# EAGLE design SmartSocket_Eth (EAGLE 6.6.0)
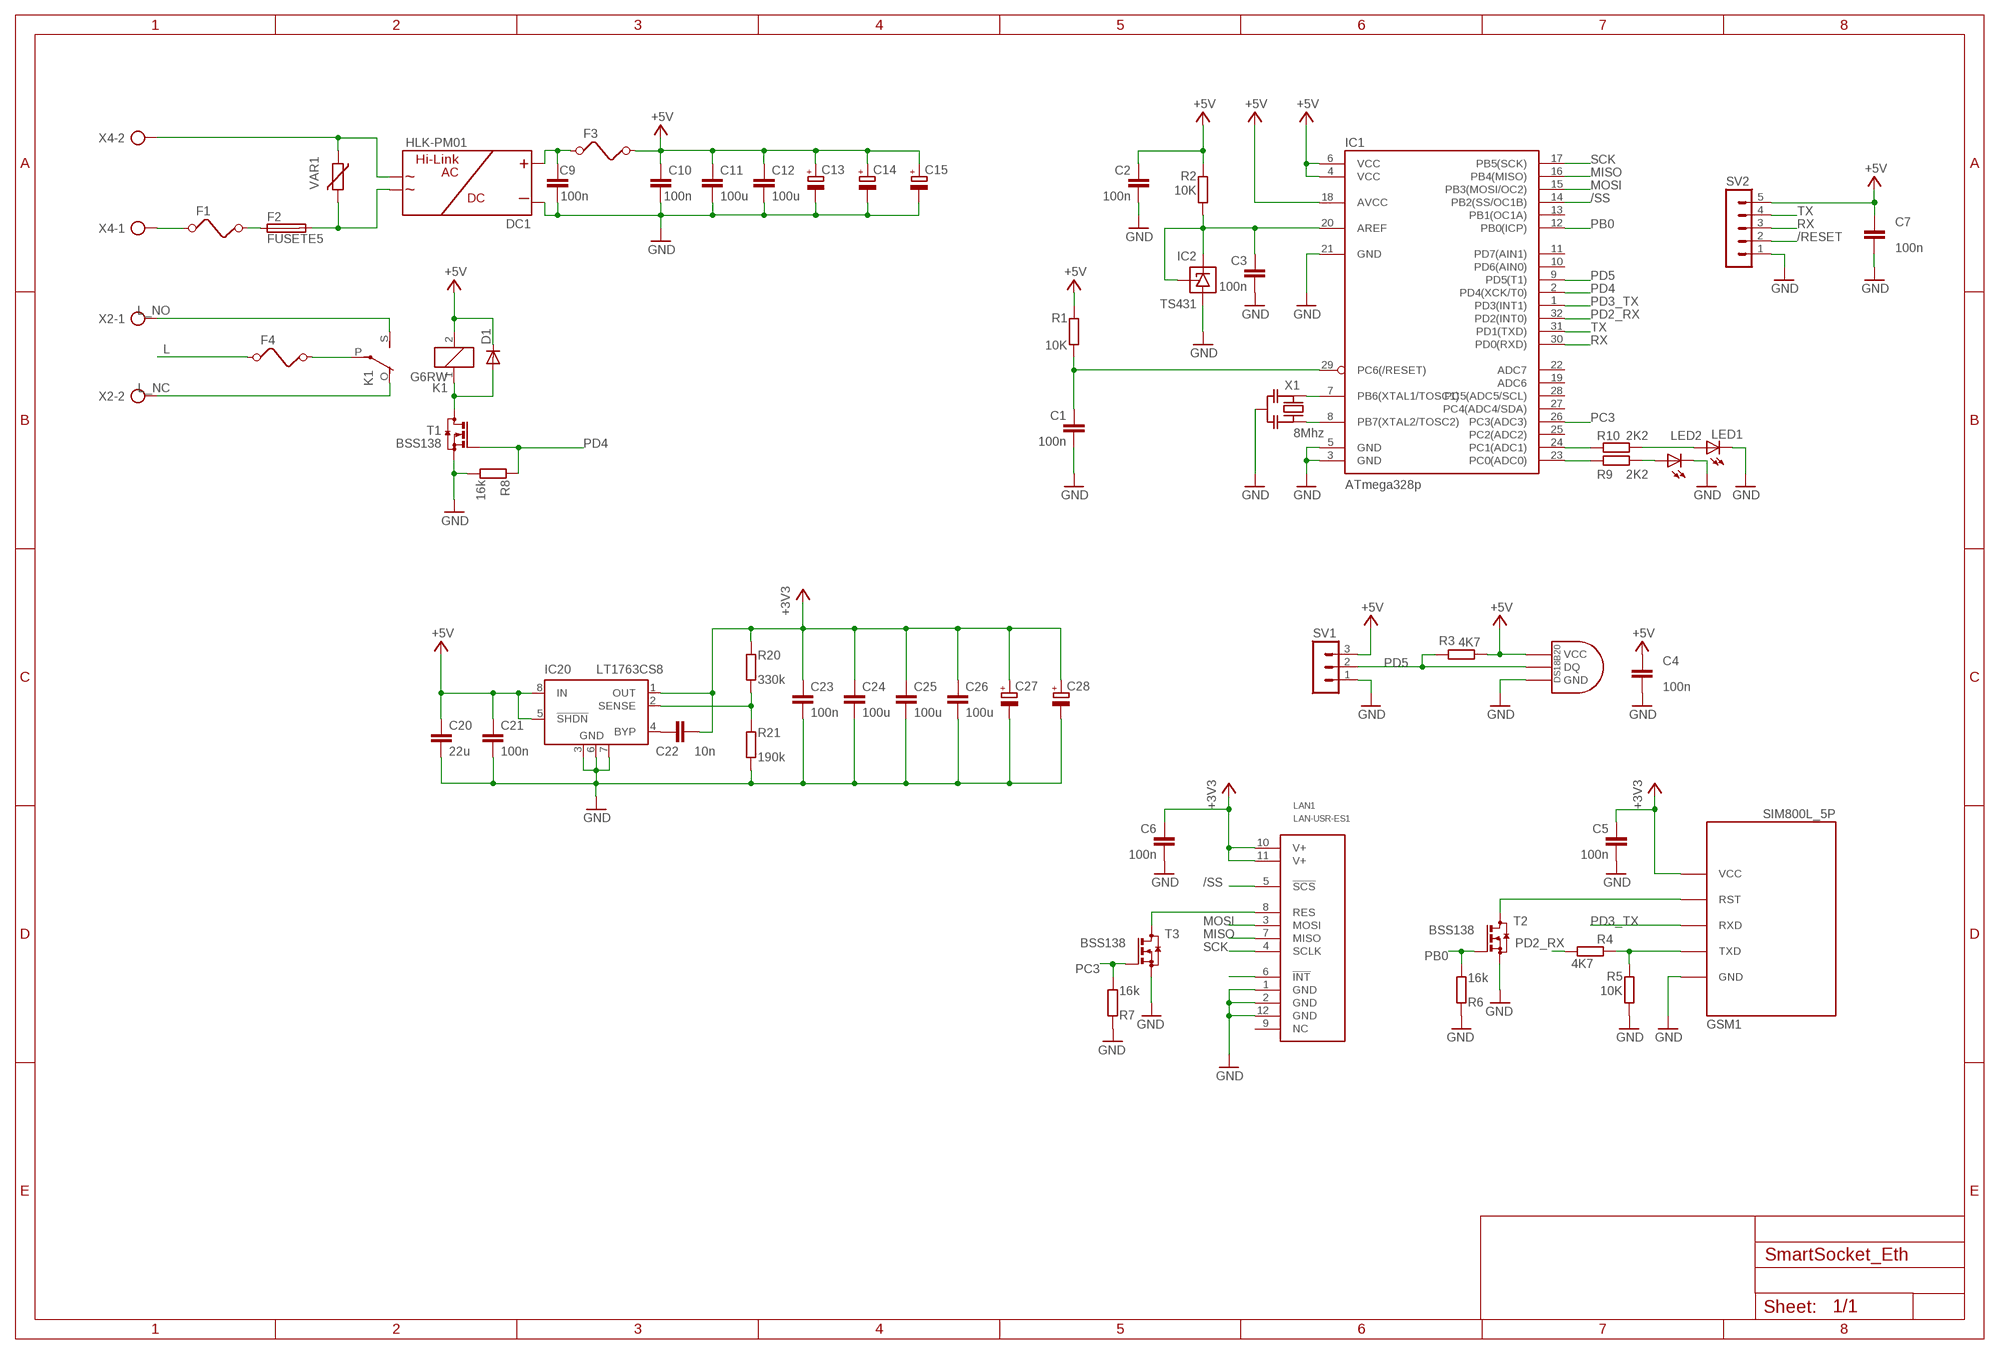
[diagram p0: schematic, sheet 1]

## Parts
18B20  DS1820TO92  [DS1820]
C1  100n  C-EUC0805  [C0805]
C2  100n  C-EUC0805  [C0805]
C3  100n  C-EUC0805  [C0805]
C4  100n  C-EUC0805  [C0805]
C5  100n  C-EUC0805  [C0805]
C6  100n  C-EUC0805  [C0805]
C7  100n  C-EUC0805  [C0805]
C9  100n  C-EUC0805  [C0805]
C10  100n  C-EUC0805  [C0805]
C11  100u  C-EUC1206  [C1206]
C12  100u  C-EUC1206  [C1206]
C13  CPOL-EUE5-6  [E5-6]
C14  CPOL-EUSMCD  [SMC_D]
C15  CPOL-EUSMCD  [SMC_D]
C20  22u  C-EUC0805  [C0805]
C21  100n  C-EUC0805  [C0805]
C22  10n  C-EUC0805  [C0805]
C23  100n  C-EUC1206  [C1206]
C24  100u  C-EUC1206  [C1206]
C25  100u  C-EUC1206  [C1206]
C26  100u  C-EUC1206  [C1206]
C27  CPOL-EUE5-4  [E5-4]
C28  CPOL-EUSMCD  [SMC_D]
D1  DIODE-MELF-MLL41  [MELF-MLL41]
DC1  HLK-PM01  [HLK-3W]
F1  FUSE  [FUSE]
F2  FUSETE5  [TE5]
F3  FUSE  [FUSE]
F4  FUSE  [FUSE]
GSM1  SIM800L_5P  [SIM800L_5P]
IC1  ATmega328p  MEGA8-AI  [TQFP32-08]
IC2  TS431  TS431CX  [SOT23]
IC20  LT1763CS8  LT1763CS8-2.5  [SOIC8]
K1  G6RW  [G6RW]
LAN1  LAN-USR-ES1  [USR-ES1]
LED1  LED3MM  [LED3MM]
LED2  LED3MM  [LED3MM]
R1  10K  R-EU_M0805  [M0805]
R2  10K  R-EU_M0805  [M0805]
R3  4K7  R-EU_M0805  [M0805]
R4  4K7  R-EU_M0805  [M0805]
R5  10K  R-EU_M0805  [M0805]
R6  16k  R-EU_M0805  [M0805]
R7  16k  R-EU_M0805  [M0805]
R8  16k  R-EU_M0805  [M0805]
R9  2K2  R-EU_M0805  [M0805]
R10  2K2  R-EU_M0805  [M0805]
R20  330k  R-EU_M0805  [M0805]
R21  190k  R-EU_M0805  [M0805]
SV1  MA03-1  [MA03-1]
SV2  MA05-1  [MA05-1]
T1  BSS138  BSS123  [SOT23]
T2  BSS138  BSS123  [SOT23]
T3  BSS138  BSS123  [SOT23]
VAR1  VARISTORS07K40  [S07K40]
X1  8Mhz  CERMOSC-CERALOCK-CSTCE_G  [CERALOCK_CSTCE_G]
X2  AK500/2  [AK500/2]
X4  AK500/2  [AK500/2]

## Nets
+3V3: C5.2 C6.2 C22.1 C23.1 C24.1 C25.1 C26.1 C27.+ C28.+ GSM1.P$1(VCC) IC20.1(OUT) LAN1.10(V+) LAN1.11(V+) R20.2
+5V: 18B20.VDD(VCC) C2.2 C4.2 C7.2 C10.2 C11.1 C12.1 C13.+ C14.+ C15.+ C20.1 C21.1 D1.C F3.2 IC1.4(VCC) IC1.6(VCC) IC1.18(AVCC) IC20.5(!SHDN) IC20.8(IN) K1.2 R1.2 R2.2 R3.2 SV1.3 SV2.5
/RESET: C1.2 IC1.29(PC6(/RESET)) R1.1 SV2.2
/SS: IC1.14(PB2(SS/OC1B)) LAN1.5(!SCS!)
AREF: C3.2 IC1.20(AREF) IC2.1(REF) IC2.2(C) R2.1
FB: IC20.2(SENSE) R20.1 R21.2
GND: 18B20.GND C1.1 C2.1 C3.1 C4.1 C5.1 C6.1 C7.1 C9.1 C10.1 C11.2 C12.2 C13.- C14.- C15.- C20.2 C21.2 C23.2 C24.2 C25.2 C26.2 C27.- C28.- DC1.P$3 GSM1.P$5(GND) IC1.3(GND) IC1.5(GND) IC1.21(GND) IC2.3(A) IC20.3(GND) IC20.6(GND) IC20.7(GND) LAN1.1(GND) LAN1.2(GND) LAN1.12(GND) LED1.K(C) LED2.K(C) R5.1 R6.1 R7.1 R8.2 R21.1 SV1.1 SV2.1 T1.2(S) T2.2(S) T3.2(S) X1.P$2(GND)
L: F1.1 F4.1 X4.1
L_NC: K1.O(2:O) X2.2
L_NO: K1.S(2:S) X2.1
MISO: IC1.16(PB4(MISO)) LAN1.7(MISO)
MOSI: IC1.15(PB3(MOSI/OC2)) LAN1.3(MOSI)
N: DC1.P$2 F2.2 VAR1.2
N$1: DC1.P$1 VAR1.1 X4.2
N$2: C9.2 DC1.P$4 F3.1
N$3: F4.2 K1.P(2:P)
N$4: GSM1.P$2(RST) T2.3(D)
N$5: LED1.A R10.1
N$6: LAN1.6(!INT!)
N$7: LAN1.8(RES) T3.3(D)
N$8: D1.A K1.1 T1.3(D)
N$9: C22.2 IC20.4(BYP)
N$10: F1.2 F2.1
N$11: IC1.8(PB7(XTAL2/TOSC2)) X1.P$1
N$12: IC1.7(PB6(XTAL1/TOSC1)) X1.P$3
N$13: LED2.A R9.1
N$14: GSM1.P$4(TXD) R4.1 R5.2
PB0: IC1.12(PB0(ICP)) R6.2 T2.1(G)
PC0: IC1.23(PC0(ADC0)) R9.2
PC1: IC1.24(PC1(ADC1)) R10.2
PC3: IC1.26(PC3(ADC3)) R7.2 T3.1(G)
PD2_RX: IC1.32(PD2(INT0)) R4.2
PD3_TX: GSM1.P$3(RXD) IC1.1(PD3(INT1))
PD4: IC1.2(PD4(XCK/T0)) R8.1 T1.1(G)
PD5: 18B20.DQ IC1.9(PD5(T1)) R3.1 SV1.2
RX: IC1.30(PD0(RXD)) SV2.3
SCK: IC1.17(PB5(SCK)) LAN1.4(SCLK)
TX: IC1.31(PD1(TXD)) SV2.4
Unconnected: IC1.10(PD6(AIN0)) IC1.11(PD7(AIN1)) IC1.13(PB1(OC1A)) IC1.19(ADC6) IC1.22(ADC7) IC1.25(PC2(ADC2)) IC1.27(PC4(ADC4/SDA)) IC1.28(PC5(ADC5/SCL)) LAN1.9(NC)

## Library data of the parts
18B20 = Ava:DS1820: DS18B20 Programmable Resolution 1-Wire Digital Thermometer Description The DS18B20 digital thermometer provides 9-bit to 12-bit Celsius temperature measurements and has an alarm function with nonvolatile user-programmable upper and lower trigger points. The DS18B20 communicates over a 1-Wire® bus that by definition requires only one data line (and ground) for communication with a central microprocessor. It has an operating temperature range of -55°C to +125°C and is accurate to ±0.5°C over the range of -10°C to +85°C. In addition, the DS18B20 can derive power directly from the data line ("parasite power"), eliminating the need for an external power supply. Each DS18B20 has a unique 64-bit serial code, which allows multiple DS18B20s to function on the same 1-Wire bus. Thus, it is simple to use one microprocessor to control many DS18B20s distributed over a large area. Applications that can benefit from this feature include HVAC environmental controls, temperature monitoring systems inside buildings, equipment, or machinery, and process monitoring and control systems.
C1-C7 C9 C10 C20-C22 = rcl:C-EU: CAPACITOR, European symbol
C11 C12 C23-C26 = rcl:C-EU: CAPACITOR, European symbol; TME: GRM31CR60J107ME39L
C13-C15 C27 C28 = rcl:CPOL-EU: POLARIZED CAPACITOR, European symbol
D1 = diode:DIODE-: DIODE
DC1 = Hi-Link:HLK-PM*
F1 F3 F4 = special:FUSE: FUSE 5 x 20 mm
F2 = fuse:FUSE: Fuse; OC_FARNELL: unknown; OC_NEWARK: unknown
GSM1 = pcb:SIM800L_5P
IC1 = atmel:MEGA8: MICROCONTROLLER 8 Kbytes FLASH, 1 kbytes SRAM, 512 bytes EEPROM, USART, 6-channel 10 bit ADC, 2-channel 8 bit ADC Pin compatible with Atmega48, ATMega88, ATMega168 Source: avr.lbr; MPN: ATMEGA8-16AU; OC_FARNELL: 9171371; OC_NEWARK: 73M8863
IC2 = nh-ic:TS431: Taiwan Semiconductor TS431 According to datasheet http://www.taiwansemi.com/products/datasheet/TS431_F07.pdf. Created by Nils Hintze <n.hintze@elektronikpage.net>
IC20 = linear-technology:LT1763CS8: 500mA, Low Noise, LDO Micropower Regulators Source: http://cds.linear.com/docs/Datasheet/1763ff.pdf; MPN: LT1763CS8-2.5; OC_FARNELL: 1273616; OC_NEWARK: 57M6051
K1 = relay:G6RW: RELAY 1 x switch, Omron; OC_FARNELL: unknown; OC_NEWARK: unknown
LAN1 = Martin-Communication:LAN-USR-ES1
LED1 LED2 = led:LED: LED OSRAM: - CHIPLED LG R971, LG N971, LY N971, LG Q971, LY Q971, LO R971, LY R971 LH N974, LH R974 LS Q976, LO Q976, LY Q976 LO Q996 - Hyper CHIPLED LW Q18S LB Q993, LB Q99A, LB R99A - SideLED LS A670, LO A670, LY A670, LG A670, LP A670 LB A673, LV A673, LT A673, LW A673 LH A674 LY A675 LS A676, LA A676, LO A676, LY A676, LW A676 LS A679, LY A679, LG A679 - Hyper Micro SIDELED® LS Y876, LA Y876, LO Y876, LY Y876 LT Y87S - SmartLED LW L88C, LW L88S LB L89C, LB L89S, LG L890 LS L89K, LO L89K, LY L89K LS L896, LA L896, LO L896, LY L896 - TOPLED LS T670, LO T670, LY T670, LG T670, LP T670 LSG T670, LSP T670, LSY T670, LOP T670, LYG T670 LG T671, LOG T671, LSG T671 LB T673, LV T673, LT T673, LW T673 LH T674 LS T676, LA T676, LO T676, LY T676, LB T676, LH T676, LSB T676, LW T676 LB T67C, LV T67C, LT T67C, LS T67K, LO T67K, LY T67K, LW E67C LS E67B, LA E67B, LO E67B, LY E67B, LB E67C, LV E67C, LT E67C LW T67C LS T679, LY T679, LG T679 LS T770, LO T770, LY T770, LG T770, LP T770 LB T773, LV T773, LT T773, LW T773 LH T774 LS E675, LA E675, LY E675, LS T675 LS T776, LA T776, LO T776, LY T776, LB T776 LHGB T686 LT T68C, LB T68C - Hyper Mini TOPLED® LB M676 - Mini TOPLED Santana® LG M470 LS M47K, LO M47K, LY M47K Source: http://www.osram.convergy.de LUXEON: - LUMILED® LXK2-PW12-R00, LXK2-PW12-S00, LXK2-PW14-U00, LXK2-PW14-V00 LXK2-PM12-R00, LXK2-PM12-S00, LXK2-PM14-U00 LXK2-PE12-Q00, LXK2-PE12-R00, LXK2-PE12-S00, LXK2-PE14-T00, LXK2-PE14-U00 LXK2-PB12-K00, LXK2-PB12-L00, LXK2-PB12-M00, LXK2-PB14-N00, LXK2-PB14-P00, LXK2-PB14-Q00 LXK2-PR12-L00, LXK2-PR12-M00, LXK2-PR14-Q00, LXK2-PR14-R00 LXK2-PD12-Q00, LXK2-PD12-R00, LXK2-PD12-S00 LXK2-PH12-R00, LXK2-PH12-S00 LXK2-PL12-P00, LXK2-PL12-Q00, LXK2-PL12-R00 Source: www.luxeon.com KINGBRIGHT: KA-3528ASYC Source: www.kingbright.com
R1-R10 R20 R21 = rcl:R-EU_: RESISTOR, European symbol
SV1 = con-lstb:MA03-1: PIN HEADER; OC_FARNELL: unknown; OC_NEWARK: unknown
SV2 = con-lstb:MA05-1: PIN HEADER; OC_FARNELL: unknown; OC_NEWARK: unknown
T1-T3 = transistor-small-signal:BSS123: N-CHANNEL MOS FET
VAR1 = varistor:VARISTOR: VARISTOR
X1 = SteMarie:CERMOSC-*?
X2 X4 = con-ptr500:AK500/2: CONNECTOR; OC_FARNELL: unknown; OC_NEWARK: unknown

## Board
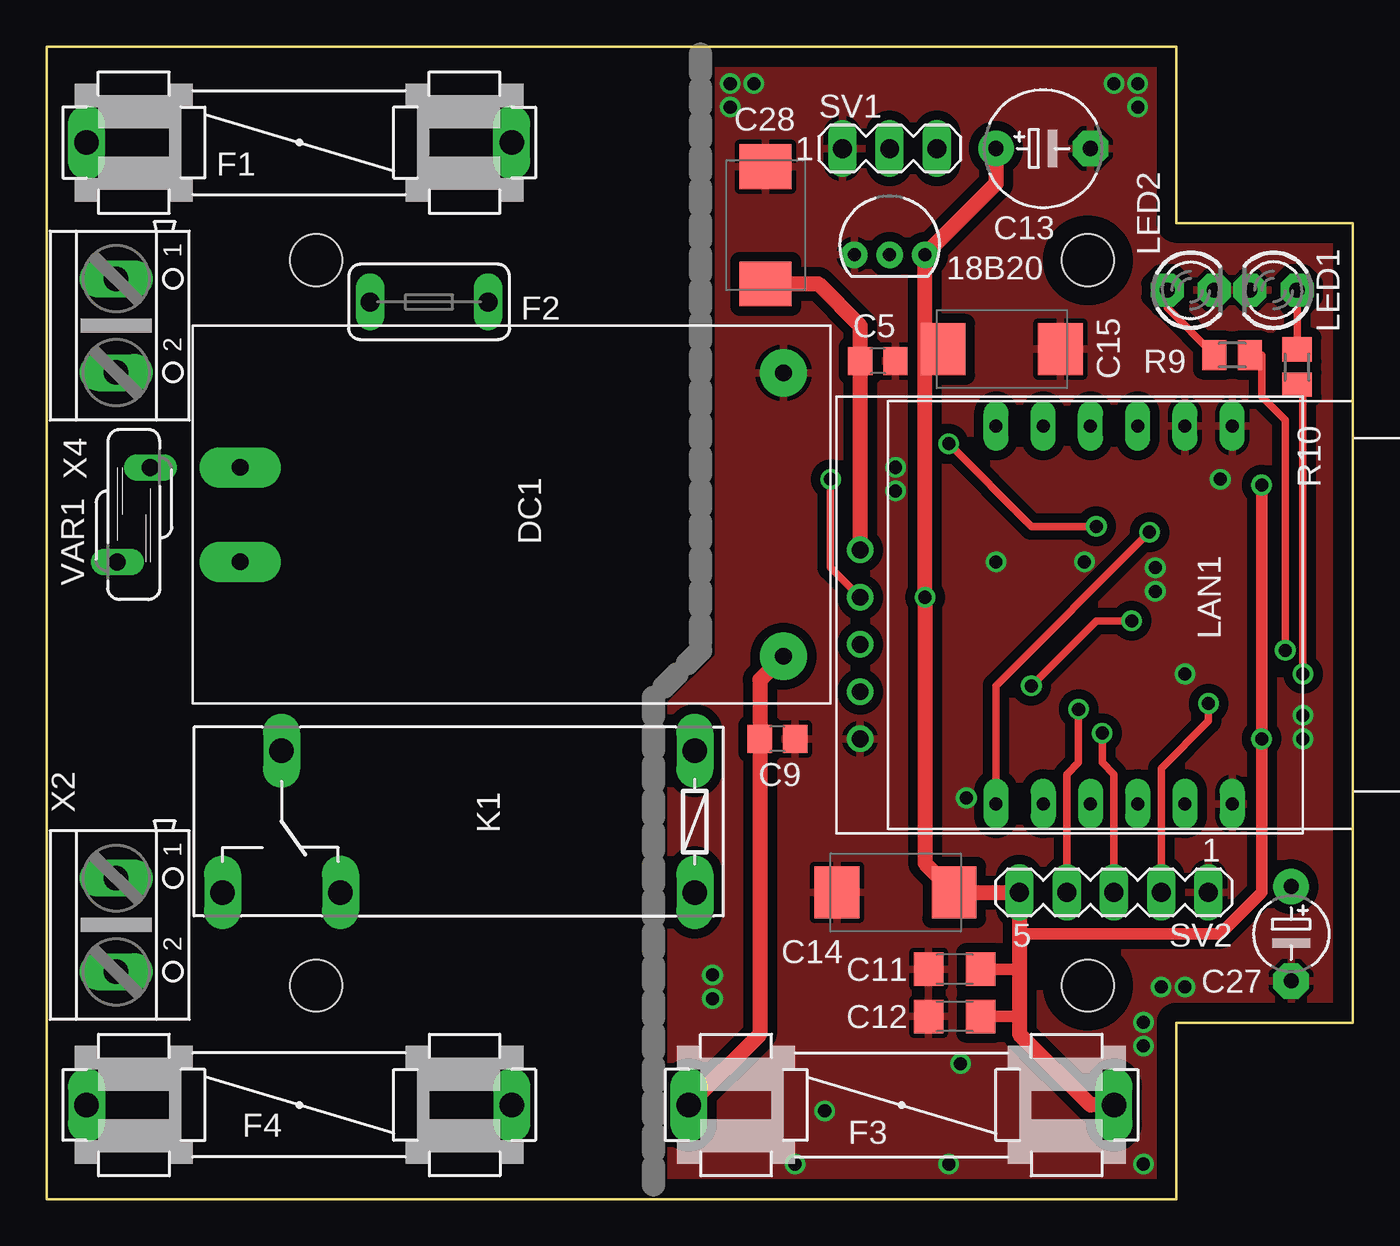
[diagram p1: board, top side]
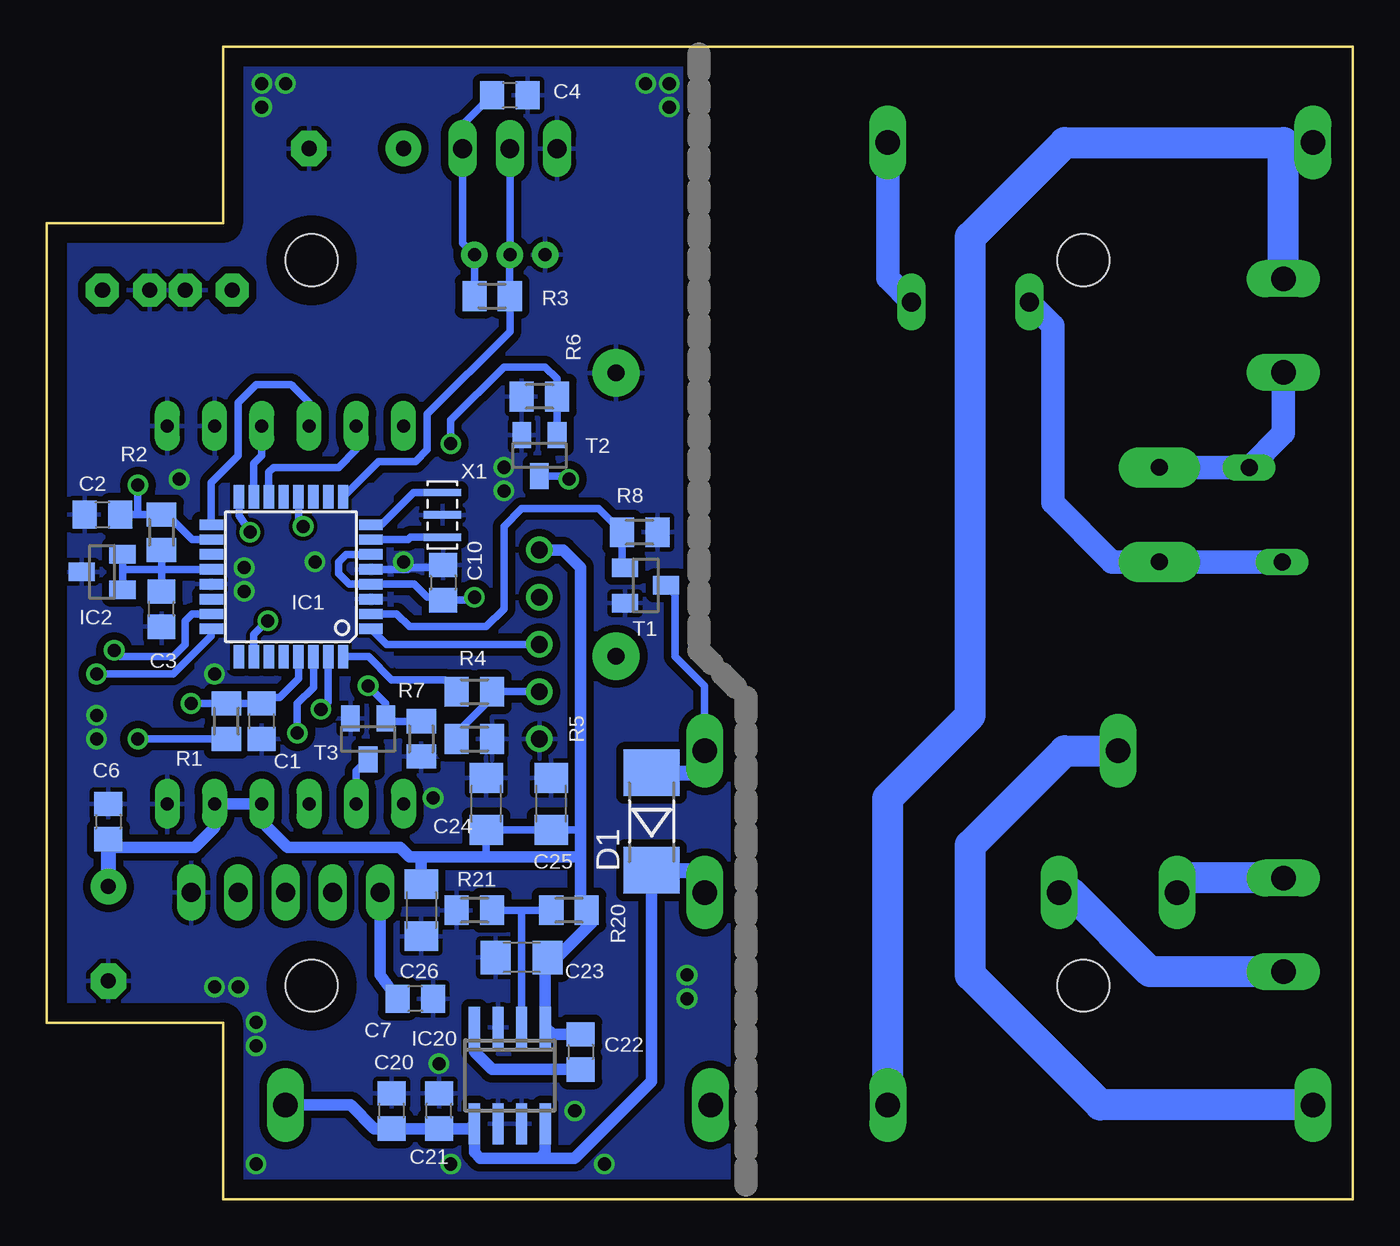
[diagram p2: board, bottom side, seen from below]

Size 70.25 x 62 mm. Coordinates in mm from the lower left corner, seen from the top.
Copper layers (1*16): Top 0.035mm / dielectric 1.5mm / Bottom 0.035mm
Design rules "default": minimum track width 10mil, minimum drill 24mil, track to track 8mil, track to pad 8mil, pad to pad 8mil, via to via 8mil, smd to smd 8mil, copper to edge 40mil, drill to drill 8mil, minimum pad ring 10mil, minimum via ring 8mil, stop-mask expansion 4mil, vias tented up to drill 0mil, thermal gap 10mil

### Footprints (pad centres in the part's own frame; a part is rotated, then mirrored left to right if it is on the bottom)
DS1820 = drill 0.7 pad 1.422: DQ 0,-1.27; GND -1.905,-1.27; VDD 1.905,-1.27
C0805 = smd 1.3 x 1.5: 1 -0.95,0; 2 0.95,0
C1206 = smd 1.6 x 1.8: 1 -1.4,0; 2 1.4,0
E5-6 = drill 0.813 pad 1.905: + -2.54,0 | drill 0.813 pad 1.905 octagon: - 2.54,0
SMC_D = smd 2.4 x 2.8: + -3.15,0; - 3.15,0
E5-4 = drill 0.813 pad 1.905: + -2.54,0 | drill 0.813 pad 1.905 octagon: - 2.54,0
MELF-MLL41 = smd 2.5 x 3: A 2.625,0; C -2.625,0
HLK-3W = drill 0.9 pad 2.184 long: P$1 -15.24,2.54; P$2 -15.24,-2.54 | drill 0.9 pad 2.54: P$3 13.97,7.62; P$4 13.97,-7.62
FUSE = drill 1.321 long: 1 -11.43,0; 2 11.43,0
TE5 = drill 1.016 long: 1 -3.175,0; 2 3.175,0
SIM800L_5P = drill 0.9 pad 1.422: P$1 -11.43,3.81; P$2 -11.43,1.27; P$3 -11.43,-1.27; P$4 -11.43,-3.81; P$5 -11.43,-6.35
TQFP32-08 = smd 1.27 x 0.559: 1 -4.293,2.8; 2 -4.293,2; 3 -4.293,1.2; 4 -4.293,0.4; 5 -4.293,-0.4; 6 -4.293,-1.2; 7 -4.293,-2; 8 -4.293,-2.8; 17 4.293,-2.8; 18 4.293,-2; 19 4.293,-1.2; 20 4.293,-0.4; 21 4.293,0.4; 22 4.293,1.2; 23 4.293,2; 24 4.293,2.8 | smd 0.559 x 1.27: 9 -2.8,-4.293; 10 -2,-4.293; 11 -1.2,-4.293; 12 -0.4,-4.293; 13 0.4,-4.293; 14 1.2,-4.293; 15 2,-4.293; 16 2.8,-4.293; 25 2.8,4.293; 26 2,4.293; 27 1.2,4.293; 28 0.4,4.293; 29 -0.4,4.293; 30 -1.2,4.293; 31 -2,4.293; 32 -2.8,4.293
SOT23 = smd 1 x 1.4: 1 -0.95,-1.1; 2 0.95,-1.1; 3 0,1.1
SOIC8 = smd 0.6 x 2.2: 1 -1.905,-2.6; 2 -0.635,-2.6; 3 0.635,-2.6; 4 1.905,-2.6; 5 1.905,2.6; 6 0.635,2.6; 7 -0.635,2.6; 8 -1.905,2.6
G6RW = drill 1.321 long: 1 -12.7,-3.81; 2 -12.7,3.81; O 6.35,3.81; P 9.525,-3.81; S 12.7,3.81
USR-ES1 = drill 0.7 pad 1.35 long: 1 -10.16,5.715; 2 -10.16,3.175; 3 -10.16,0.635; 4 -10.16,-1.905; 5 -10.16,-4.445; 6 -10.16,-6.985; 7 10.16,-6.985; 8 10.16,-4.445; 9 10.16,-1.905; 10 10.16,0.635; 11 10.16,3.175; 12 10.16,5.715
LED3MM = drill 0.813 pad 1.778 octagon: A -1.27,0; K 1.27,0
M0805 = smd 1.3 x 1.6: 1 -0.95,0; 2 0.95,0
MA03-1 = drill 1.016 long: 1 -2.54,0; 2 0,0; 3 2.54,0
MA05-1 = drill 1.016 long: 1 -5.08,0; 2 -2.54,0; 3 0,0; 4 2.54,0; 5 5.08,0
Z27 = hole 2.8: 11.5,-14.25; 50.5,-14.25; 50.5,-55.75; 11.5,-55.75
S07K40 = drill 0.914 long: 1 -0.889,-2.54; 2 0.889,2.54
CERALOCK_CSTCE_G = smd 0.4 x 2: P$1 -1.2,0; P$2 0,0; P$3 1.2,0
AK500/2 = drill 1.321 long: 1 -2.515,0; 2 2.515,0

### Placement (x,y rotation side)
18B20  45.34,52.07 0 top
C1  58.67,25.72 90 bottom
C2  67.25,36.83 0 bottom
C3  64.07,31.75 90 bottom
C4  45.34,59.37 180 bottom
C5  44.7,45.09 180 top
C6  66.93,20.32 270 bottom
C7  50.42,10.79 180 bottom
C9  39.31,24.77 180 top
C10  48.92,33.17 270 bottom
C11  48.83,12.38 180 top
C12  48.83,9.84 180 top
C13  53.59,56.52 0 top
C14  45.66,16.51 180 top
C15  51.37,45.72 0 top
C20  51.69,4.76 90 bottom
C21  49.15,4.76 90 bottom
C22  41.53,7.94 270 bottom
C23  44.7,13.02 180 bottom
C24  46.61,21.27 90 bottom
C25  43.12,21.27 90 bottom
C26  50.1,15.56 270 bottom
C27  66.93,14.29 270 top
C28  38.67,52.39 90 top
D1  37.72,20.32 90 bottom
DC1  25.65,36.83 0 top
F1  13.59,56.83 0 top
F2  20.57,48.26 180 top
F3  45.97,5.08 0 top
F4  13.59,5.08 180 top
GSM1  55.18,31.11 0 top
IC1  57.1,33.48 180 bottom
IC2  67.27,33.75 90 bottom
IC20  45.34,6.67 180 bottom
K1  22.16,20.32 180 top
LAN1  58.04,31.43 270 top
LED1  65.98,48.9 180 top
LED2  61.53,48.9 0 top
R1  60.58,25.72 270 bottom
R2  64.07,35.88 90 bottom
R3  46.29,48.58 180 bottom
R4  47.24,27.3 180 bottom
R5  47.24,24.77 180 bottom
R6  43.75,43.18 0 bottom
R7  50.1,24.77 90 bottom
R8  38.35,35.88 0 bottom
R9  63.75,45.4 0 top
R10  67.25,44.77 270 top
R20  42.16,15.56 0 bottom
R21  47.24,15.56 0 bottom
SV1  45.34,56.52 0 top
SV2  57.4,16.51 180 top
T1  38.04,33.02 270 bottom
T2  43.75,40.01 180 bottom
T3  52.96,24.77 180 bottom
U$1  [Z27]  0.25,0 90 top
VAR1  4.7,36.83 180 top
X1  48.97,36.81 270 bottom
X2  3.75,14.76 270 top
X4  3.75,46.99 270 top

### Tracks (layer width: path | path; a pad name or v marks a point on that pad's centre or on a via)
+3V3
  Top 0.61: 43.75,46.99 C5.2
  Top 0.813: C28.+ 41.5,49.24 43.75,46.99 GSM1.P$1
  Bottom 0.406: 41.53,20.19 41.53,20 | 46.61,18.41 C24.1 C25.1 41.53,19.87 41.53,20
  Bottom 0.61: C22.1 43.05,8.89 IC20.1 43.43,12.89 C23.1 42.8,13.02 40.89,14.92 40.89,15.24 R20.2 41.53,15.88 41.53,18.41 | 41.53,18.41 41.53,20 41.53,33.98 42.48,34.92 GSM1.P$1 | 50.1,18.41 50.74,18.41 51.24,18.92 57.27,18.92 58.67,20.32 LAN1.10 LAN1.11 61.21,20 62.3,18.92 66.48,18.92 C6.2 | 50.1,18.41 46.61,18.41 41.53,18.41 | C26.1 50.1,18.41
  Bottom 0.813: C6.2 C27.+
+5V  (via drill 0.7)
  Top 0.61: v65.34,38.42 v65.34,24.77 65.34,16.51 63.12,14.29 52.32,14.29 | C11.1 52.32,12.38 | C12.1 52.32,9.84
  Top 0.813: F3.2 56.13,5.08 52.32,8.89 52.32,9.84 52.32,12.38 52.32,14.29 SV2.5 C14.+ 47.24,18.07 v47.24,32.38 47.24,46.67 | 47.24,46.67 18B20.VDD 51.05,54.61 C13.+ | C15.+ 47.24,46.67
  Bottom 0.406: IC1.6 54.15,34.69 54.55,34.29 54.55,33.66 53.98,33.09 IC1.4 50.48,33.09 49.78,32.38 49.08,32.38 C10.2 47.4,32.22 v47.24,32.38 | IC1.18 62.41,35.48 63.75,36.83 64.39,36.83 R2.2 64.39,36.83 65.34,36.83 | 65.34,36.83 C2.2 | v65.34,38.42 65.34,36.83 | R1.2 v65.34,24.77 | C4.2 47.88,57.78 SV1.3 47.88,51.44 18B20.VDD R3.2
  Bottom 0.61: 43.75,2.22 46.93,2.22 47.24,2.54 IC20.5 47.5,3.81 C21.1 C20.1 52.64,3.81 53.91,5.08 F3.2 | 43.75,2.22 41.85,2.22 37.72,6.35 D1.C | IC20.8 43.43,2.54 43.75,2.22 | C7.2 52.32,12.07 SV2.5
  Bottom 0.813: D1.C 35.41,17.7 K1.2
/RESET  (via drill 0.7)
  Top 0.406: SV2.2 59.94,23.18 62.48,25.72 v62.48,26.67
  Bottom 0.406: v62.48,26.67 59.31,26.67 R1.1 C1.2 58.35,26.99 57.72,26.99 56.7,28.01 IC1.29
/SS
  Bottom 0.406: IC1.14 58.3,39.11 58.04,39.37 54.55,39.37 53.59,40.32 LAN1.5
AREF
  Bottom 0.406: IC2.2 66.17,33.97 | 66.17,33.97 IC2.1 | 64.07,33.88 C3.2 | IC1.20 64.07,33.88 | 64.07,33.88 66.08,33.88 arc90 66.17,33.97 | 64.07,33.88 R2.1
FB
  Bottom 0.406: IC20.2 44.7,15.56 | R20.1 44.7,15.56 | R21.2 44.7,15.56
GND  (via drill 0.7)
  Bottom 0.406: IC1.5 50.82,33.88 50.74,33.97 49.07,33.97 C10.1
  other vias: 51.05,34.29 55.82,34.29 35.81,12.06 35.81,10.79 41.85,4.76 49.15,7.3 59.94,11.43 61.21,11.43 67.56,26.04 67.56,24.77 58.67,60.01 57.4,60.01 58.67,58.74 36.77,60.01 38.04,60.01 36.77,58.74 40.26,1.91 48.51,1.91 58.99,1.91 58.99,8.26 58.99,9.53 45.66,38.1 45.66,39.37 59.63,33.97 59.63,32.7 61.21,28.26 63.12,38.73 49.47,21.59
  pour Top (isolate 0.508): 36.13,61.91 60.9,61.91 60.9,52.39 70.1,52.39 70.1,9.53 60.58,9.53 60.58,0.32 33.59,0.32 33.59,26.67 36.13,29.21
  pour Bottom (isolate 0.406): 36.13,61.91 60.9,61.91 60.9,52.39 70.1,52.39 70.1,9.53 60.58,9.53 60.58,0.32 33.59,0.32 33.59,26.67 36.13,29.21
  pour Bottom: 51.69,38.42 62.17,38.42 62.17,28.57 51.69,28.57
L
  Bottom 1.27: 3.75,56.83 F1.1
  Bottom 1.676: F4.1 25.02,21.59 20.57,26.04 20.57,51.75 15.49,56.83 3.75,56.83 X4.1
L_NC
  Bottom 1.27: 15.18,16.51 K1.O
  Bottom 1.676: X2.2 10.92,12.25 15.18,16.51
L_NO
  Bottom 1.27: 8.69,17.28 K1.S
  Bottom 1.676: X2.1 8.69,17.28
MISO  (via drill 0.7)
  Top 0.406: v59.31,35.88 51.05,27.62 LAN1.7
  Bottom 0.406: IC1.16 59.9,36.79 v59.31,35.88
MOSI
  Bottom 0.406: IC1.15 59.1,39.58 58.67,40.01 LAN1.3
N
  Bottom 1.27: VAR1.2 DC1.P$2 12.95,34.29 16.13,37.47 16.13,46.99 F2.2
N$1
  Bottom 1.27: DC1.P$1 VAR1.1 3.75,41.21 X4.2
N$2
  Top 0.813: DC1.P$4 38.36,27.94 C9.2 38.36,8.89 F3.1
N$3
  Bottom 1.676: F4.2 13.59,5.08 20.57,12.06 20.57,19.05 15.49,24.13 K1.P
N$4  (via drill 0.7)
  Top 0.406: v42.16,38.73 42.16,33.97 GSM1.P$2
  Bottom 0.406: T2.3 42.33,38.91 v42.16,38.73
N$5
  Top 0.406: LED1.A R10.1
N$7
  Bottom 0.406: T3.3 53.59,23.03 LAN1.8
N$8
  Bottom 0.406: T1.3 36.45,32.53 36.45,29.21 34.86,27.62 K1.1
  Bottom 0.813: D1.A 35.41,22.95 K1.1
N$9
  Bottom 0.61: C22.2 46.29,6.99 47.24,7.94 IC20.4
N$10
  Bottom 1.27: F2.1 25.02,49.53 F1.2
N$11
  Bottom 0.406: X1.P$1 50.5,38.01 52.23,36.28 IC1.8
N$12
  Bottom 0.406: IC1.7 50.81,35.48 50.68,35.61 X1.P$3
N$13
  Top 0.406: LED2.A 60.26,47.95 R9.1
N$14
  Bottom 0.406: GSM1.P$4 R4.1 46.29,26.99 47.88,25.4 R5.2
PB0  (via drill 0.7)
  Top 0.406: v56.45,36.2 52.96,36.2 v48.51,40.64
  Bottom 0.406: T2.1 R6.2 42.8,44.13 43.43,44.77 45.66,44.77 48.51,41.91 v48.51,40.64 | IC1.12 56.7,36.45 v56.45,36.2
PC0  (via drill 0.7)
  Top 0.406: v66.61,29.53 66.61,41.91 65.34,43.18 65.34,45.4 R9.2
  Bottom 0.406: IC1.23 62.43,31.48 62.8,31.11 62.8,29.84 63.44,29.21 66.29,29.21 v66.61,29.53
PC1  (via drill 0.7)
  Top 0.406: R10.2 67.56,43.5 v67.56,28.26
  Bottom 0.406: IC1.24 61.39,30.3 63.44,28.26 v67.56,28.26
PC3  (via drill 0.7)
  Top 0.406: v58.36,31.11 56.45,31.11 v52.96,27.62
  Bottom 0.406: R7.2 51.86,25.71 T3.1 52.01,26.67 v52.96,27.62 | IC1.26 59.1,30.37 v58.36,31.11
PD2_RX
  Bottom 0.406: IC1.32 52.94,29.19 51.69,27.94 48.83,27.94 R4.2
PD3_TX
  Bottom 0.406: GSM1.P$3 51.97,29.84 IC1.1
PD4
  Bottom 0.406: IC1.2 51.42,31.48 50.74,30.8 46.61,30.8 45.66,31.75 45.66,36.2 44.7,37.15 40.57,37.15 R8.1 39.3,34.14 T1.1
PD5
  Bottom 0.406: SV1.2 18B20.DQ R3.1 45.34,47.94 45.34,46.67 49.78,42.23 49.78,40.32 50.42,39.69 52.39,39.69 IC1.9
RX  (via drill 0.7)
  Top 0.406: SV2.3 57.4,22.86 56.77,23.5 v56.77,25.08
  Bottom 0.406: IC1.30 55.9,27.54 56.77,26.67 v56.77,25.08
SCK
  Bottom 0.406: IC1.17 61.39,38.55 59.94,40.01 59.94,42.86 58.99,43.81 57.19,43.81 arc45 57.01,43.74 56.13,42.86 LAN1.4
TX  (via drill 0.7)
  Top 0.406: SV2.4 54.86,22.86 55.5,23.5 v55.5,26.35
  Bottom 0.406: IC1.31 55.1,26.75 v55.5,26.35

### Text on the board
tDocu: L | F200mA | N | L_NO | L_NC | F5A | @600mA
bDocu: DC | AC